# Altium project POWER_SUPPLY.PrjPcb (part 1 of 8)
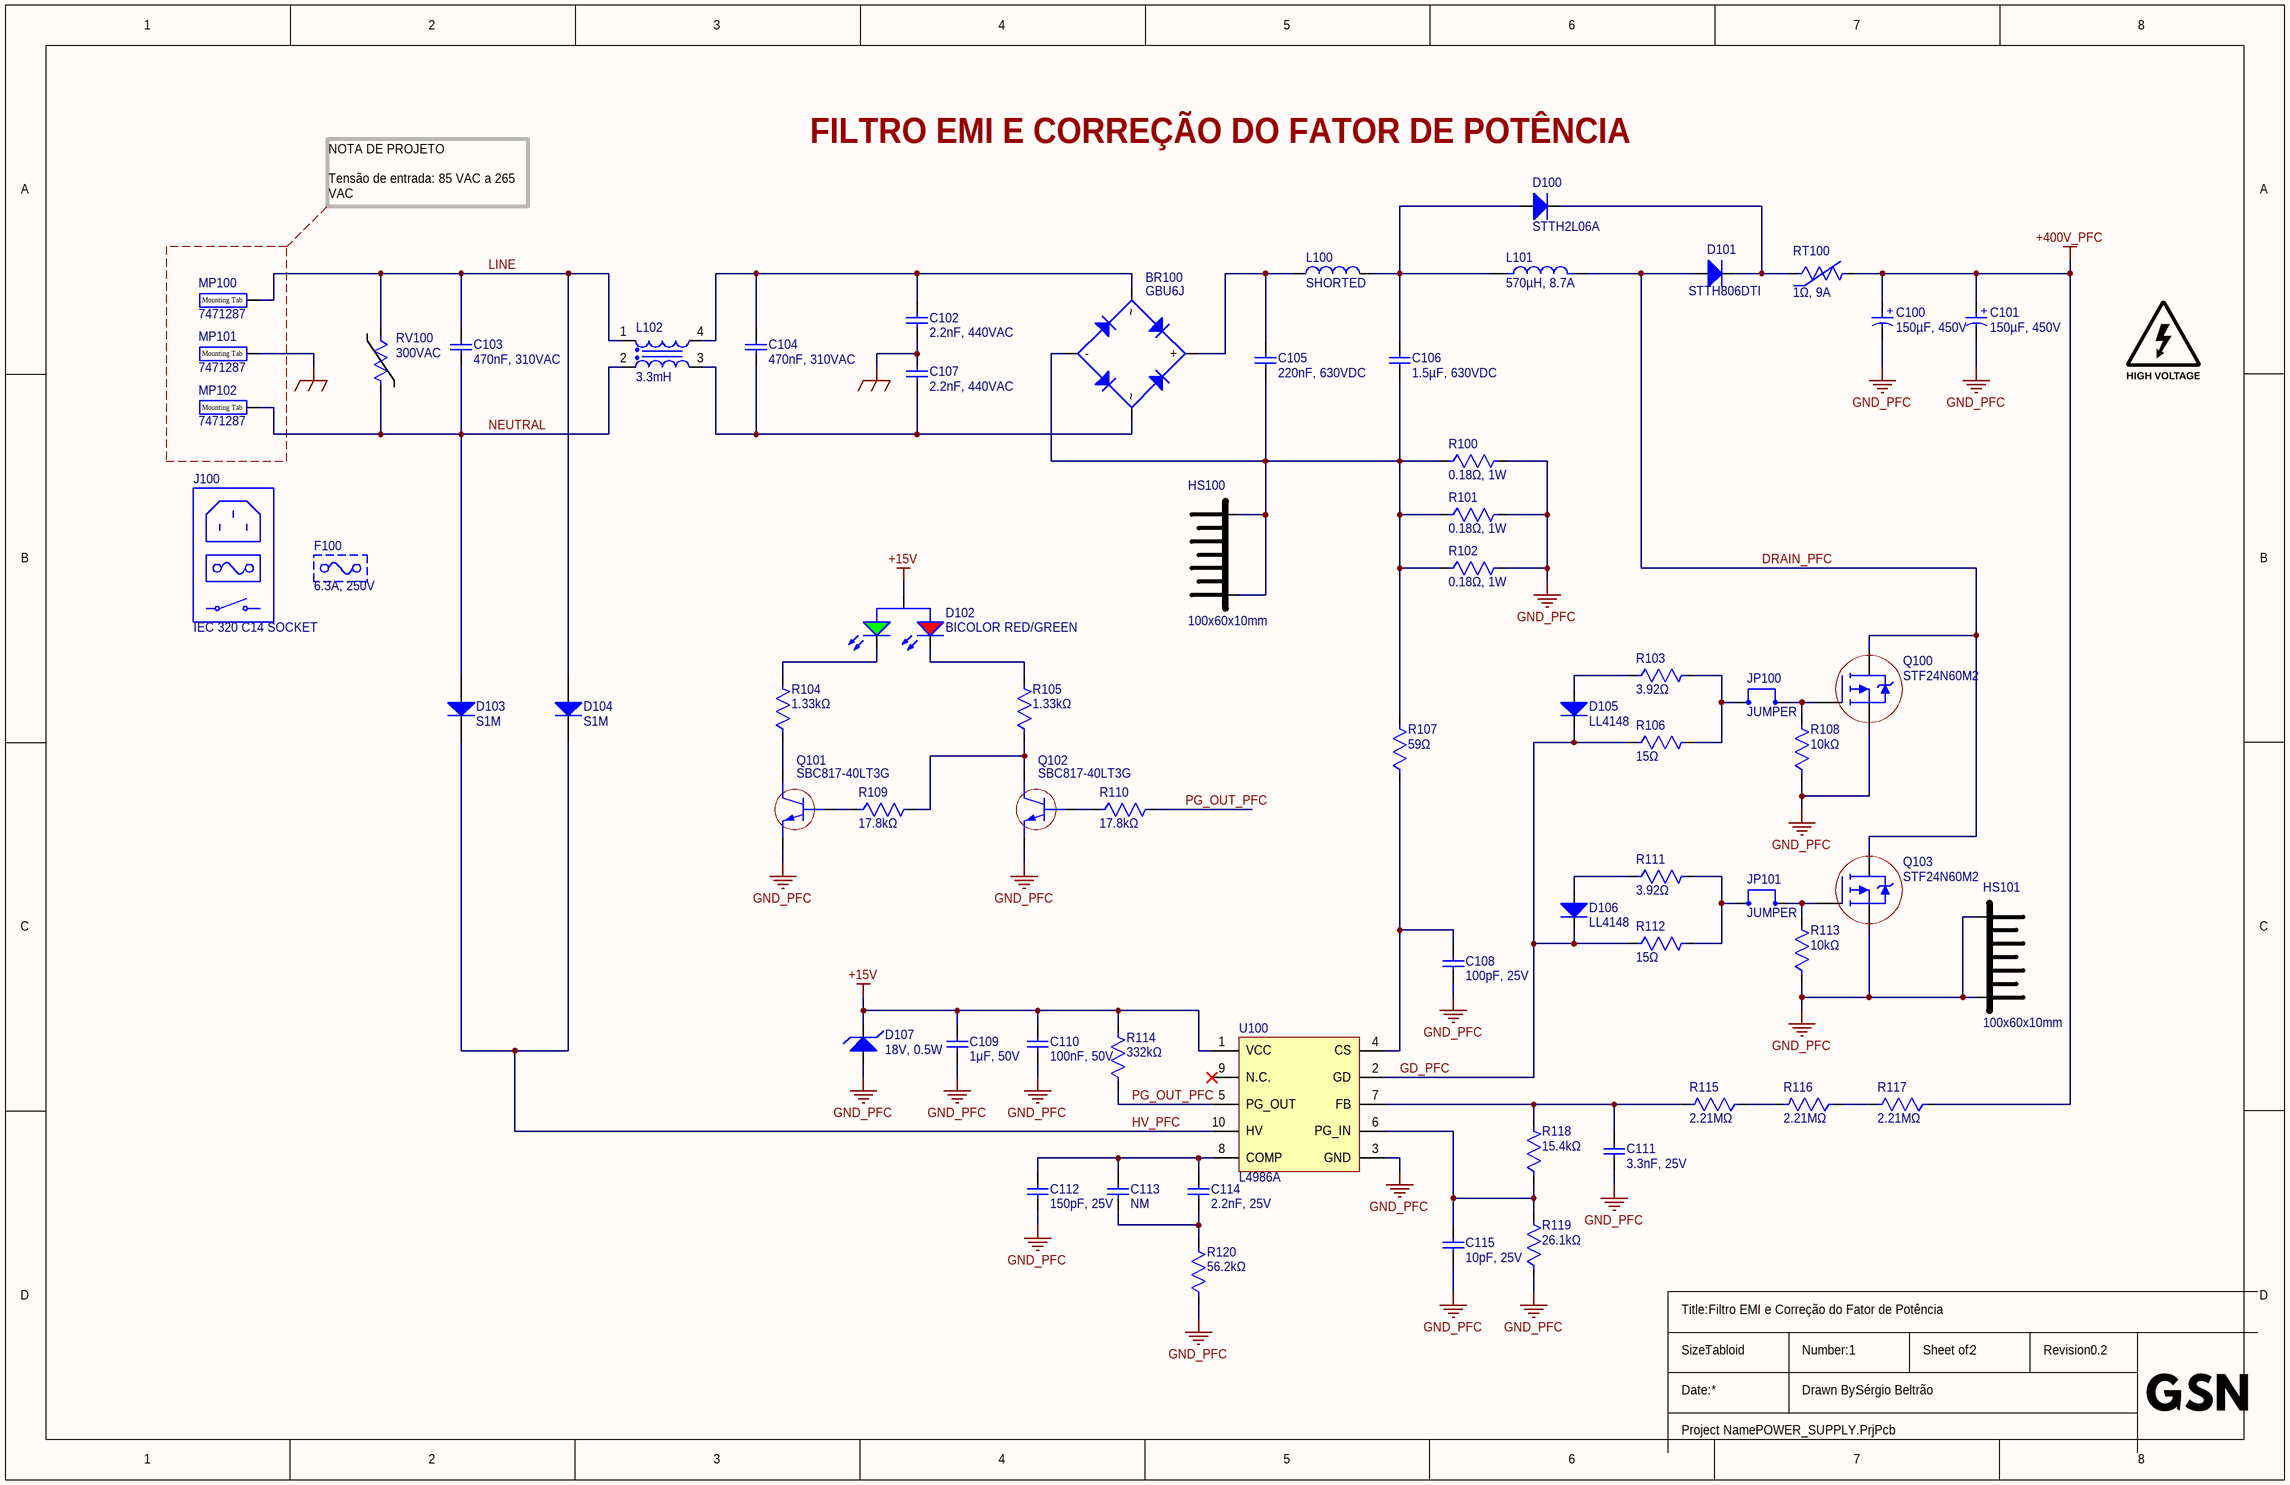
[diagram p0: 1_PFC.SchDoc]
Revision: 0.2; DrawnBy: Sérgio Beltrão
3 sheets, 138 parts. Net scope: global (net labels, ports and power ports of the same name join across sheets).
Board file: POWER_SUPPLY.PcbDoc
Sheets:
  1_PFC.SchDoc
  2_FLYBACK_AUXILIAR.SchDoc
  3_LLC.SchDoc

## Sheet 1_PFC.SchDoc
size Tabloid; SheetNumber: 1; SheetTotal: 2; SPICEModelCacheUVZVXIGA: <root> / <DocumentId>UVZVXIGA</DocumentId> / <CacheFrame Number="0"> / <Model Name="0603_885012106020_470nf" Kind="CKT"> / <Text>******* / .subckt 0603_885012106020_470nF 1 2 / Rser 1 3 0.00976845934589 / Lser 2 4 2.50682976E-10 / C1 3 4 0.00000047 / Rpar 3 4 1100000000 / .ends 0603_885012106020_470nF</Text> / </Model> / <Model Name="0603_885012206095r_100nf" Kind="CKT"> / <Text>******* / .subckt 0603_885012206095R_100nF 1 2 / Rser 1 3 0.0157659152881 / Lser 2 4 3.10171966E-10 / C1 3 4 0.0000001 / Rpar 3 4 5000000000 / .ends 0603_885012206095R_100nF</Text> / </Model> / <Model Name="0603_885012206062_3.3nf" Kind="CKT"> / <Text>******* / .subckt 0603_885012206062_3.3nF 1 2 / Rser 1 3 0.09865 / Lser 2 4 0.0000000003316 / C1 3 4 0.0000000033 / Rpar 3 4 10000000000 / .ends 0603_885012206062_3.3nF</Text> / </Model> / <Model Name="0603_885012006032_10pf" Kind="CKT"> / <Text>******* / .subckt 0603_885012006032_10pF 1 2 / Rser 1 3 0.445774201336 / Lser 2 4 4.28073844E-10 / C1 3 4 0.00000000001 / Rpar 3 4 10000000000 / .ends 0603_885012006032_10pF</Text> / </Model> / <Model Name="0603_885012206053_100pf" Kind="CKT"> / <Text>******* / .subckt 0603_885012206053_100pF 1 2 / Rser 1 3 0.91003 / Lser 2 4 0.00000000024509 / C1 3 4 0.0000000001 / Rpar 3 4 10000000000 / .ends 0603_885012206053_100pF</Text> / </Model> / <Model Name="0603_885012206126_1uf" Kind="CKT"> / <Text>******* / .subckt 0603_885012206126_1uF 1 2 / Rser 1 3 0.0115 / Lser 2 4 0.0000000008 / C1 3 4 0.000001 / Rpar 3 4 500000000 / .ends 0603_885012206126_1uF</Text> / </Model> / <Model Name="890334025039cs_470nf" Kind="CKT"> / <Text>******* / .subckt 890334025039CS_470nF 1 2 / Rser 1 3 0.037 / Lser 2 4 0.0000000065 / C1 3 4 0.00000047 / Rpar 3 4 21276595744.6809 / .ends 890334025039CS_470nF</Text> / </Model> / <Model Name="7447070_100u" Kind="CKT"> / <Text>******* / .subckt 7447070_100u 1 2 / Rp 1 2 2743 / Cp 1 2 18.895p / Rs 1 N3 0.035 / L1 N3 2 100u / .ends 7447070_100u</Text> / </Model> / <Model Name="0603_885012006039_150pf" Kind="CKT"> / <Text>******* / .subckt 0603_885012006039_150pF 1 2 / Rser 1 3 0.097154893647 / Lser 2 4 5.82598828E-10 / C1 3 4 0.00000000015 / Rpar 3 4 10000000000 / .ends 0603_885012006039_150pF</Text> / </Model> / <Model Name="0603_885012206061_2.2nf" Kind="CKT"> / <Text>******* / .subckt 0603_885012206061_2.2nF 1 2 / Rser 1 3 0.12731 / Lser 2 4 0.00000000032293 / C1 3 4 0.0000000022 / Rpar 3 4 10000000000 / .ends 0603_885012206061_2.2nF</Text> / </Model> / <Model Name="890414026009cs_1.5uf" Kind="CKT"> / <Text>******* / .subckt 890414026009CS_1.5uF 1 2 / Rser 1 3 0.0258997562049 / Lser 2 4 1.4071119672E-08 / C1 3 4 0.0000015 / Rpar 3 4 5000000000 / .ends 890414026009CS_1.5uF</Text> / </Model> / <Model Name="861011483006_150uf" Kind="CKT"> / <Text>******* / .subckt 861011483006_150uF 1 2 / Rser 1 3 0.188 / Lser 2 4 1.3236124722E-08 / C1 3 4 0.00015 / Rpar 3 4 333333.333333333 / .ends 861011483006_150uF</Text> / </Model> / <Model Name="890414025003cs_220nf" Kind="CKT"> / <Text>******* / .subckt 890414025003CS_220nF 1 2 / Rser 1 3 0.04474 / Lser 2 4 0.00000000656 / C1 3 4 0.00000022 / Rpar 3 4 25000000000 / .ends 890414025003CS_220nF</Text> / </Model> / <Model Name="cmb" Kind="CKT"> / <Text>******** / .SUBCKT  CMB    1  2  3  4  PARAMS: / R_R9  N12325  3  {R2} / R_R8  N13265  N13287  {Rs4} / Kn_K6a  L_L11  L_L12  0.9999 / Kn_K6b  L_L11  L_L13  0.9999 / Kn_K6c  L_L11  L_L14  0.9999 / Kn_K6d  L_L12  L_L13  0.9999 / Kn_K6e  L_L12  L_L14  0.9999 / Kn_K6f  L_L13  L_L14  0.9999 / R_R3  N12571  N12583  {Rs3} / R_R10  N13777  4  {R2} / C_C10  N13029  N12821  {ck} / R_R20  N13215  N13229  {dR4} / L_L11  N12821  N12295  {dL4} / R_R17  N12267  N12273  {dR3} / L_L8  N13265  N13287  {L4} / R_R7  N13287  N13305  {Rs3} / L_L9  N12295  N12307  {L5} / Kn_K4  L_L7  L_L8  1 / R_R2  N12583  N12599  {Rs2} / Kn_K5  L_L9  L_L10  1 / R_R16  N13229  N13249  {dR6} / Kn_K7a  L_L15  L_L16  0.9999 / Kn_K7b  L_L15  L_L17  0.9999 / Kn_K7c  L_L15  L_L18  0.9999 / Kn_K7d  L_L16  L_L17  0.9999 / Kn_K7e  L_L16  L_L18  0.9999 / Kn_K7f  L_L17  L_L18  0.9999 / C_C5  N12273  N12289  {dC4} / L_L6  N13287  N13305  {L3} / L_L7  N12307  N12571  {L4} / R_R6  N13305  N13319  {Rs2} / R_R21  1  N12257  {Rdc} / Kn_K3  L_L5  L_L6  1 / L_L16  N12257  N12799  {dL3} / C_C8  N13215  N13741  {dC3} / L_L18  N13023  N13215  {dL3} / R_R1  N12599  3  {Rs1} / R_R13  N12289  N12295  {dR5} / L_L4  N13305  N13319  {L2} / L_L5  N12571  N12583  {L3} / R_R15  N13755  N13249  {dR5} / R_R5  N13319  4  {Rs1} / R_R18  N12257  N12273  {dR4} / Kn_K2  L_L3  L_L4  1 / R_R19  N13741  N13229  {dR3} / L_L15  N12799  N12273  {dL3} / L_L17  N13229  N13023  {dL3} / L_L3  N12583  N12599  {L2} / R_R11  N12295  N12307  {Rs5} / L_L2  N13319  4  {L1} / C_C4  N13249  N13265  {C2} / L_L10  N13249  N13265  {L5} / Kn_K1  L_L1  L_L2  1 / R_R14  N12273  N12295  {dR6} / C_C6  N13229  N13755  {dC4} / L_L12  N12273  N12821  {dL4} / L_L14  N13029  N13229  {dL4} / L_L1  N12599  3  {L1} / C_C1  N12307  N12325  {C1} / R_R12  N13249  N13265  {Rs5} / C_C2  N13265  N13777  {C1} / R_R22  2  N13215  {Rdc} / C_C9  N13023  N12799  {ck} / R_R4  N12307  N12571  {Rs4} / C_C3  N12295  N12307  {C2} / L_L13  N13249  N13029  {dL4} / C_C7  N12257  N12267  {dC3} / .ends  CMB</Text> / </Model> / <Model Name="xl_7448256033_3.3m" Kind="CKT"> / <Text>**** / .subckt XL_7448256033_3.3m 1 2 3 4 / X1  1  2  3  4  CMB  PARAMS: / +  DL3=0.00000085 / +  DL4=0.000000058 / +  DC3=0.0000000000144 / +  DC4=0.000000000001 / +  DR3=17 / +  dR4=9k / +  DR5=23 / +  dR6=2k / +  Rdc=18.752m / +  ck=4pF / +  L1=2.6m / +  L2=700u / +  L3=23u / +  L4=4u / +  L5=110.4n / +  C1=5p / +  C2=2.8p / +  Rs1=16k / +  Rs2=6k / +  RS3=500 / +  RS4=600 / +  RS5=900 / +  R2=10.41 / .ends XL_7448256033_3.3m</Text> / <Dependency>0\cmb</Dependency> / </Model> / </CacheFrame> / </root>

### Parts
BR100  GBU6J  [GBU]
C100  150µF, 450V  [WCAP-AIG8_D22H50]
C101  150µF, 450V  [WCAP-AIG8_D22H50]
C102  2.2nF, 440VAC  [CAP_5US63V7_VIS]
C103  470nF, 310VAC  [WCAP-FTXX_L18W8H14]
C104  470nF, 310VAC  [WCAP-FTXX_L18W8H14]
C105  220nF, 630VDC  [WCAP-FTXH_L18W8.5H14.5]
C106  1.5µF, 630VDC  [WCAP-FTXH_L26.5W14.5H24.5]
C107  2.2nF, 440VAC  [CAP_5US63V7_VIS]
C108  100pF, 25V  [WCAP-CSGP_0603_L1.6W0.8H0.8_Wave]
C109  1μF, 50V  [WCAP-CSGP_0603_L1.6W0.8H0.8_Wave]
C110  100nF, 50V  [WCAP-CSGP_0603_L1.6W0.8H0.8_Wave]
C111  3.3nF, 25V  [WCAP-CSGP_0603_L1.6W0.8H0.8_Wave]
C112  150pF, 25V  [WCAP-CSGP_0603_L1.6W0.8H0.8_Wave]
C113  NM  [WCAP-CSGP_0603_L1.6W0.8H0.8_Wave]
C114  2.2nF, 25V  [WCAP-CSGP_0603_L1.6W0.8H0.8_Wave]
C115  10pF, 25V  [WCAP-CSGP_0603_L1.6W0.8H0.8_Wave]
D100  STTH2L06A  [SMA]
D101  STTH806DTI  [TO-220AC]
D102  BICOLOR RED/GREEN  [LED_3MM_GREEN_RED]
D103  S1M  [SMA]
D104  S1M  [SMA]
D105  LL4148  [SOD-80-DIODE]
D106  LL4148  [SOD-80-DIODE]
D107  18V, 0.5W  [SOD-80-DIODE]
F100  6.3A, 250V  (mechanical)
GRPH100  DANGER HIGH VOLTAGE ICON  [DANGER_HIGH_VOLTAGE]  (value not drawn)  (no BOM)
HS100  100x60x10mm  [HEATSINK_100MM_60MM_10MM]
HS101  100x60x10mm  [HEATSINK_100MM_60MM_10MM]
J100  IEC 320 C14 SOCKET  (mechanical)
JP100  JUMPER  [JUMPER_TX_8P2MM]
JP101  JUMPER  [JUMPER_TX_8P2MM]
L100  SHORTED  [7447070]
L101  570µH, 8.7A  [IND-TOR-MMTR014901_NO_MH]
L102  3.3mH  [WE-CMB_Type XL_L30W21H35]
MP100  7471287  [7471287]
MP101  7471287  [7471287]
MP102  7471287  [7471287]
Q100  STF24N60M2  [TO-220FP]
Q101  SBC817-40LT3G  [SOT-23-3]
Q102  SBC817-40LT3G  [SOT-23-3]
Q103  STF24N60M2  [TO-220FP]
R100  0.18Ω, 1W  [2512-WAVE]
R101  0.18Ω, 1W  [2512-WAVE]
R102  0.18Ω, 1W  [2512-WAVE]
R103  3.92Ω  [0805-WAVE]
R104  1.33kΩ  [1206-WAVE]
R105  1.33kΩ  [1206-WAVE]
R106  15Ω  [0805-WAVE]
R107  59Ω  [1206-WAVE]
R108  10kΩ  [0805-WAVE]
R109  17.8kΩ  [0603-WAVE]
R110  17.8kΩ  [0603-WAVE]
R111  3.92Ω  [0805-WAVE]
R112  15Ω  [0805-WAVE]
R113  10kΩ  [0805-WAVE]
R114  332kΩ  [0603-WAVE]
R115  2.21MΩ  [1206-WAVE]
R116  2.21MΩ  [1206-WAVE]
R117  2.21MΩ  [1206-WAVE]
R118  15.4kΩ  [0603-WAVE]
R119  26.1kΩ  [0603-WAVE]
R120  56.2kΩ  [0603-WAVE]
RT100  1Ω, 9A  [B57237S0109M054]
RV100  300VAC  [MOV-B72214S0301K101]
U100  L4986A  [SSOP-10]

### Nets
+15V: C109.2 C110.2 D102.2(A) D107.1(K) R114.2 U100.1(VCC)
+400V_PFC: C100.1(P) C101.1(P) R117.1 RT100.2
EARTH: C102.1 C107.2 MP101.1
GND_PFC: C100.2(N) C101.2(N) C108.1 C109.1 C110.1 C111.1 C112.1 C115.1 D107.2(A) HS101.H1 HS101.H2 Q100.3(SOURCE) Q101.2(E) Q102.2(E) Q103.3(SOURCE) R100.2 R101.2 R102.2 R108.1 R113.1 R119.1 R120.1 U100.3(GND)
DRAIN_PFC: D101.2(A) L101.2 Q100.2(DRAIN) Q103.2(DRAIN)
GD_PFC: D105.1(K) D106.1(K) R106.1 R112.1 U100.2(GD)
HV_PFC: D103.1(K) D104.1(K) U100.10(HV)
LINE: C103.2 D104.2(A) L102.1 MP100.1 RV100.1
NEUTRAL: C103.1 D103.2(A) L102.2 MP102.1 RV100.2
PG_OUT_PFC: R110.2 R114.1 U100.5(PG_OUT)
NetBR100_1: BR100.1(+) C105.2 L100.1
NetBR100_2: BR100.2 C102.2 C104.2 L102.4
NetBR100_3: BR100.3 C104.1 C107.1 L102.3
NetBR100_4: BR100.4(-) C105.1 C106.1 HS100.H1 HS100.H2 R100.1 R101.1 R102.1 R107.2
NetC106_2: C106.2 D100.2(A) L100.2 L101.1
NetC108_2: C108.2 R107.1 U100.4(CS)
NetC111_2: C111.2 R115.2 R118.2 U100.7(FB)
NetC112_2: C112.2 C113.2 C114.2 U100.8(COMP)
NetC113_1: C113.1 C114.1 R120.2
NetC115_2: C115.2 R118.1 R119.2 U100.6(PG_IN)
NetD100_1: D100.1(K) D101.1(K) RT100.1
NetD102_1: D102.1(KG) R104.2
NetD102_3: D102.3(KR) R105.2
NetD105_2: D105.2(A) R103.1
NetD106_2: D106.2(A) R111.1
NetJP100_1: JP100.1 R103.2 R106.2
NetJP100_2: JP100.2 Q100.1(GATE) R108.2
NetJP101_1: JP101.1 R111.2 R112.2
NetJP101_2: JP101.2 Q103.1(GATE) R113.2
NetQ101_1: Q101.1(B) R109.1
NetQ101_3: Q101.3(C) R104.1
NetQ102_1: Q102.1(B) R110.1
NetQ102_3: Q102.3(C) R105.1 R109.2
NetR115_1: R115.1 R116.2
NetR116_1: R116.1 R117.2

Not connected (* = marked no-connect by the designer): U100 9(N.C.)*

### Notes on the sheet
- FILTRO EMI E CORREÇÃO DO FATOR DE POTÊNCIA
- NOTA DE PROJETO
  Tensão de entrada: 85 VAC a 265 VAC
- Filtro EMI e Correção do Fator de Potência
- Title:
- Size:
- Tabloid
- Number:
- Sheet of:
- Revision:
- Date:
- Project Name:
- Drawn By:
- (in symbol 861011483006) +